# Altium schematic sheet DT JFET Pre.SchDoc
size A
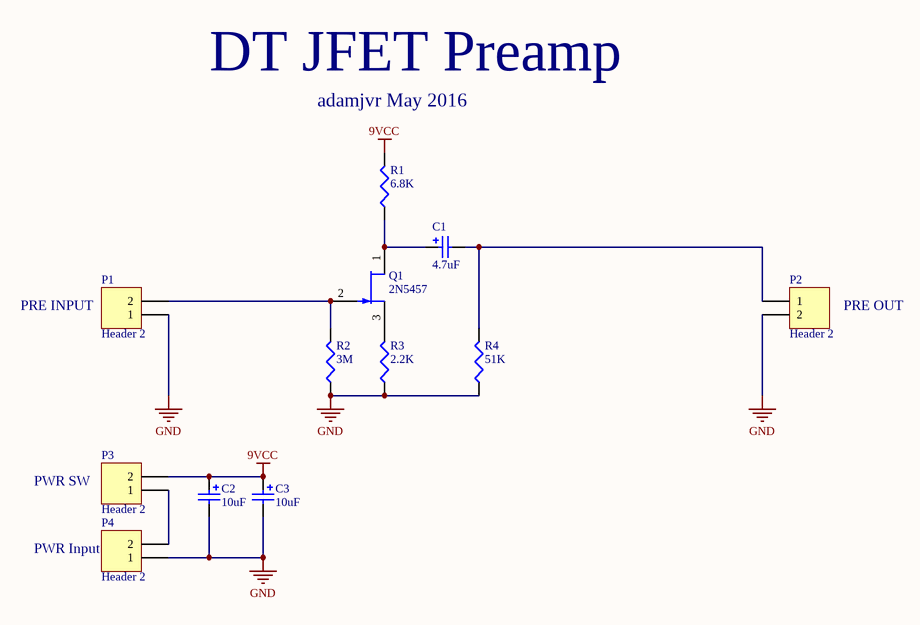
[diagram p0: DT JFET Pre.SchDoc]

## Parts
C1  4.7uF  [4X6mmCAP]
C2  10uF  [4X6mmCAP]
C3  10uF  [4X6mmCAP]
P1  Header 2  [HDR1X2]
P2  Header 2  [HDR1X2]
P3  Header 2  [HDR1X2]
P4  Header 2  [HDR1X2]
Q1  2N5457  [TO-92A]
R1  6.8K  [R0805]
R2  3M  [R0805]
R3  2.2K  [R0805]
R4  51K  [R0805]

## Nets
9VCC: C2.1 C3.1 P3.2 R1.2
GND: C2.2 C3.2 P1.1 P2.2 P4.1 R2.1 R3.1 R4.1
NetC1_1: C1.1 Q1.1(D) R1.1
NetC1_2: C1.2 P2.1 R4.2
NetP1_2: P1.2 Q1.2(G) R2.2
NetP3_1: P3.1 P4.2
NetQ1_3: Q1.3(S) R3.2

## Notes on the sheet
- DT JFET Preamp
- adamjvr May 2016
- PRE INPUT
- PRE OUT
- PWR SW
- PWR Input

## Library data of the parts
C1 = UMW1V4R7MDD1TP: CAP ALUM 4.7UF 20% 35V RADIAL; MFR: Nichicon; Pin Count #: 2; Type: Aluminum Capacitor RAdial throughole; Lead-Free ?: Yes; Designer: Adam Vadala-Roth; MFR #: UMW1V4R7MDD1TP; Status: Active; Mounting: Through Hole; Datasheet: http://nichicon-us.com/english/products/pdfs/e-umw.pdf; Height: 6mm; Tolerance: 20%; Cost: 0.08766 @ 1000; Voltage: 35V; Date Created: 10 May 2016; Last Modified: 10 May 2016; Value: 4.7uF
C2 C3 = UMW1C100MDD1TP: CAP ALUM 10UF 20% 16V RADIAL; MFR: Nichicon; Pin Count #: 2; Type: aluminum capacitor throughhole; Lead-Free ?: Yes; Designer: Adam Vadala-Roth; MFR #: UMW1C100MDD1TP; Status: Active; Mounting: Through hole; Datasheet: http://nichicon-us.com/english/products/pdfs/e-umw.pdf; Height: 6mm; Tolerance: 20%; Cost: 0.08766; Voltage: 16V; Date Created: 10 May 2016; Last Modified: 10 May 2016; Value: 10uF
P1-P4 = Header 2: Header, 2-Pin; LatestRevisionDate: 17-Jul-2002; LatestRevisionNote: Re-released for DXP Platform.; Publisher: Altium Limited
Q1 = 2N5457: JFET N-CH 25V 0.31W TO-92; MFR: Central-Semiconductor-Corp; Pin Count #: 3; Type: JFET Transistor; Lead-Free ?: Yes; Designer: Adam Vadala-Roth; MFR #: 2N5457; Status: Active; Mounting: Throughhole; Datasheet: http://www.centralsemi.com/PDFs/products/2N5457-5459.PDF; Height: 10mm; Tolerance: N/A; Cost: 1.13100 @ 1000; Voltage: 25V; Date Created: 10 May 2016; Last Modified: 10 May 2016
R1 = RC2012F682CS: RES SMD 6.8K OHM 1% 1/8W 0805; MFR: Samsung-Electro-Mechanics-America,-Inc.; Pin Count #: 2; Lead-Free ?: Yes; Designer: Adam Vadala-Roth; MFR #: RC2012F682CS; Status: Active; Mounting: SMT/SMD; Datasheet: https://media.digikey.com/pdf/Data%20Sheets/Samsung%20PDFs/RC_Series_ds.pdf; Height: 0.60mm; Tolerance: 1%; Cost: 0.00408 @ 1000; Type: Chip Resistor 0805; Voltage: 1/8W; Date Created: 10 May 2016; Last Modified: 10 May 2016; Value: 6.8K
R2 = RC2012F305CS: RES SMD 3M OHM 1% 1/8W 0805; MFR: Samsung-Electro-Mechanics-America,-Inc.; Pin Count #: 2; Lead-Free ?: Yes; Designer: Adam Vadala-Roth; MFR #: RC2012F305CS; Status: Active; Mounting: SMT/SMD; Datasheet: https://media.digikey.com/pdf/Data%20Sheets/Samsung%20PDFs/RC_Series_ds.pdf; Height: 0.60mm; Tolerance: 1%; Cost: 0.00408 @ 1000; Type: Chip Resistor 0805; Voltage: 1/8W; Date Created: 10 May 2016; Last Modified: 10 May 2016; Value: 3M
R3 = RC2012F222CS: RES SMD 2.2K OHM 1% 1/8W 0805; MFR: Samsung-Electro-Mechanics-America,-Inc.; Pin Count #: 2; Lead-Free ?: Yes; Designer: Adam Vadala-Roth; MFR #: RC2012F222CS; Status: Active; Mounting: SMT/SMD; Datasheet: https://media.digikey.com/pdf/Data%20Sheets/Samsung%20PDFs/RC_Series_ds.pdf; Height: 0.60mm; Tolerance: 1%; Cost: 0.00182	 @ 1000; Type: Chip Resistor 0805; Voltage: 1/8W; Date Created: 10 May 2016; Last Modified: 10 May 2016; Value: 2.2K
R4 = RC2012F513CS: RES SMD 51K OHM 1% 1/8W 0805; MFR: Samsung-Electro-Mechanics-America,-Inc.; Pin Count #: 2; Lead-Free ?: Yes; Designer: Adam Vadala-Roth; MFR #: RC2012F513CS; Status: Active; Mounting: SMT/SMD; Datasheet: https://media.digikey.com/pdf/Data%20Sheets/Samsung%20PDFs/RC_Series_ds.pdf; Height: 0.60mm; Tolerance: 1%; Cost: 0.00408 @ 1000; Type: Chip Resistor 0805; Voltage: 1/8W; Date Created: 10 May 2016; Last Modified: 10 May 2016; Value: 51K